# Altium schematic sheet LCD.SchDoc
size A
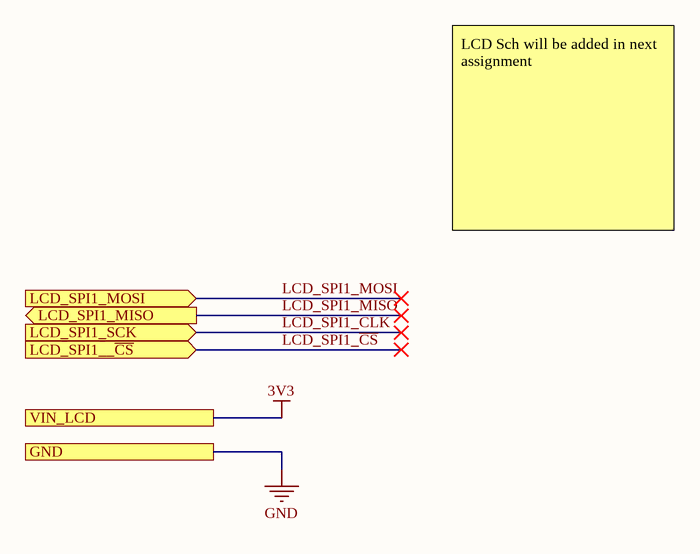
[diagram p0: LCD.SchDoc]

## Ports
GND, LCD_SPI1__~{CS} (in), LCD_SPI1_MISO (out), LCD_SPI1_MOSI (in), LCD_SPI1_SCK (in), VIN_LCD

## Nets
3V3: port VIN_LCD
GND: port GND
LCD_SPI1_~{CS}: port LCD_SPI1__~{CS}
LCD_SPI1_CLK: port LCD_SPI1_SCK
LCD_SPI1_MISO: port LCD_SPI1_MISO
LCD_SPI1_MOSI: port LCD_SPI1_MOSI

## Notes on the sheet
- LCD Sch will be added in next assignment